# Altium schematic sheet 0_ESP_batt_shield-Overview.SchDoc
size A4; SheetNumber: 1; SheetTotal: 3
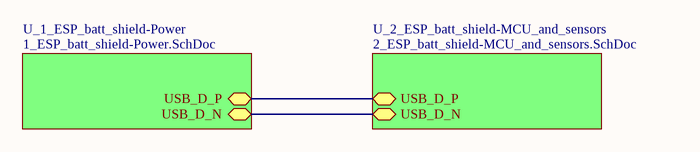
[diagram p0: 0_ESP_batt_shield-Overview.SchDoc]

## Sub-sheets
U_1_ESP_batt_shield-Power = 1_ESP_batt_shield-Power.SchDoc: USB_D_N (bidir), USB_D_P (bidir)
U_2_ESP_batt_shield-MCU_and_sensors = 2_ESP_batt_shield-MCU_and_sensors.SchDoc: USB_D_N (bidir), USB_D_P (bidir)

## Nets
(unnamed): sheet U_1_ESP_batt_shield-Power/USB_D_N, sheet U_2_ESP_batt_shield-MCU_and_sensors/USB_D_N
(unnamed): sheet U_1_ESP_batt_shield-Power/USB_D_P, sheet U_2_ESP_batt_shield-MCU_and_sensors/USB_D_P